# Altium schematic sheet Temp.SchDoc
size A4
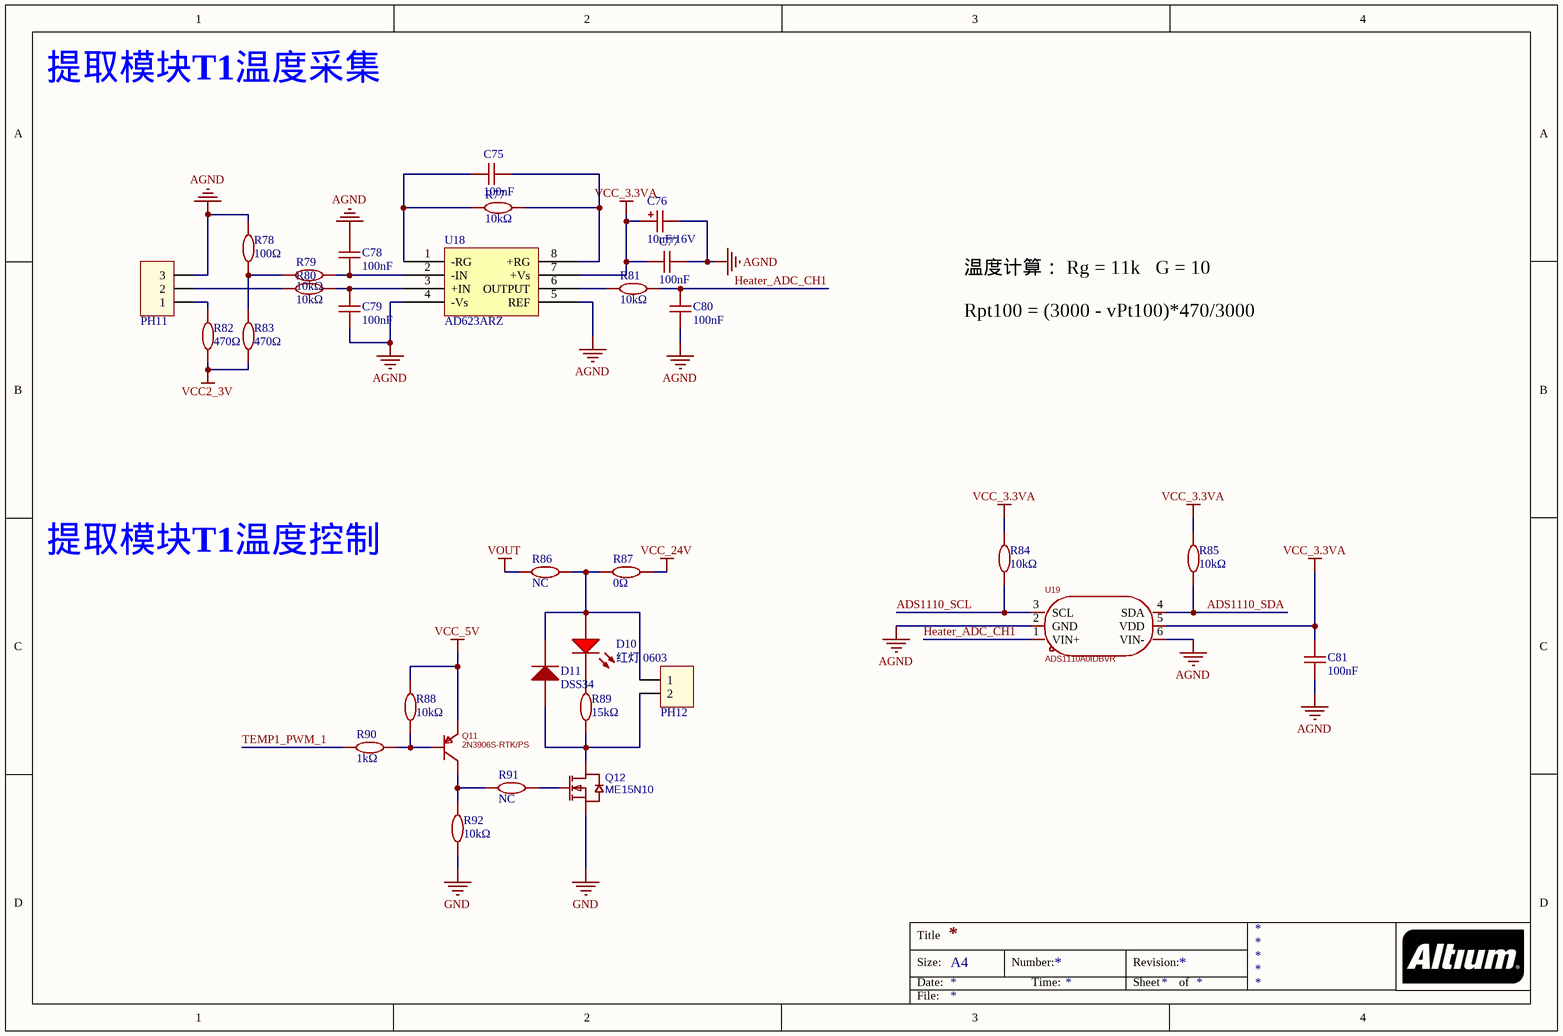
[diagram p0: Temp.SchDoc]

## Parts
C75  100nF  [C0603]
C76  10uF/16V  [CASE-A_3216]
C77  100nF  [C0603]
C78  100nF  [C0603]
C79  100nF  [C0603]
C80  100nF  [C0603]
C81  100nF  [C0603]
D10  红灯 0603  [LED_0603]
D11  DSS34  [SOD-123]
PH11  PH2.0-3P  [PH2.0-3P 弯针]  (value not drawn)
PH12  PH2.0-2P  [PH2.0-2P 弯针]  (value not drawn)
Q11  2N3906S-RTK/PS  [SOT-23-3_L2.9-W1.3-P1.90-LS2.4-TR]
Q12  ME15N10  [TO-252-2_L6.6-W6.1-P4.57-LS9.9-TL-CW]
R77  10kΩ  [R0603]
R78  100Ω  [R0603]
R79  10kΩ  [R0603]
R80  10kΩ  [R0603]
R81  10kΩ  [R0603]
R82  470Ω  [R0603]
R83  470Ω  [R0603]
R84  10kΩ  [R0603]
R85  10kΩ  [R0603]
R86  NC  [R1206]
R87  0Ω  [R1206]
R88  10kΩ  [R0603]
R89  15kΩ  [R0603]
R90  1kΩ  [R0603]
R91  NC  [R0603]
R92  10kΩ  [R0603]
U18  AD623ARZ  [SOP-8_150mil]
U19  ADS1110A0IDBVR  [SOT-23-6_L2.9-W1.6-P0.95-LS2.8-BR]

## Nets
AGND: C76.2 C77.2 C78.2 C79.1 C80.1 C81.1 PH11.3 R78.2 U18.4(-Vs) U18.5(REF) U19.2(GND) U19.6(VIN-)
GND: Q12.3(S) R92.2
VCC2_3V: R82.1 R83.1
VCC_3.3VA: C76.1 C77.1 C81.2 R84.1 R85.1 U18.7(+Vs) U19.5(VDD)
VCC_5V: Q11.1(E) R88.1
VCC_24V: R87.2
VOUT: R86.1
ADS1110_SCL: R84.2 U19.3(SCL)
ADS1110_SDA: R85.2 U19.4(SDA)
Heater_ADC_CH1: C80.2 R81.2 U19.1(VIN+)
TEMP1_PWM_1: R90.1
NetC75_1: C75.1 R77.1 U18.1(-RG)
NetC75_2: C75.2 R77.2 U18.8(+RG)
NetC78_1: C78.1 R79.1 U18.2(-IN)
NetC79_2: C79.2 R80.1 U18.3(+IN)
NetD10_A: D10.A D11.2(K) PH12.1 R86.2 R87.1
NetD10_K: D10.K R89.2
NetD11_1: D11.1(A) PH12.2 Q12.2(D) R89.1
NetPH11_1: PH11.1 R82.2
NetPH11_2: PH11.2 R80.2
NetQ11_2: Q11.2(B) R88.2 R90.2
NetQ11_3: Q11.3(C) R91.1 R92.1
NetQ12_1: Q12.1(G) R91.2
NetR78_1: R78.1 R79.2 R83.2
NetR81_1: R81.1 U18.6(OUTPUT)

## Notes on the sheet
- 提取模块T1温度采集
- 温度计算： Rg = 11k   G = 10
  Rpt100 = (3000 - vPt100)*470/3000
- 提取模块T1温度控制
- Title
- Size:
- Date:
- A4
- Number:
- Time:
- Revision:
- Sheet
- of
- File:

## Library data of the parts
C75 C77-C81 = 100nF/50V,C0603: 贴片电容,X7R; ComponentLink1Description: 供应商链接; ComponentLink1URL: http://www.szlcsc.com/product/details_16531.html
C76 = 10uF/16V,CASE-A_3216 : 钽电容;±10%;16V; ComponentLink1Description: 供应商链接; ComponentLink1URL: http://www.szlcsc.com/product/details_7643.html
D10 = 红灯 0603: 发光二极管; ComponentLink1Description: 供应商链接; ComponentLink1URL: http://www.szlcsc.com/product/details_2659.html
D11 = DSS34,SOD-123: 肖特基二极管; ComponentLink1Description: 供应商链接; ComponentLink1URL: http://www.szlcsc.com/product/details_9093.html
Q11 = 2N3906S-RTK/PS: Manufacturer: KEC; Symbol: 2N3906S-RTK/PS_C5300004; Add into BOM: yes; Current - Collector(Ic): 200mA; Collector - Emitter Voltage VCEO: 40V; Pd - Power Dissipation: 350mW; DC Current Gain: 300@10mA,1V; Transition frequency(fT): 250MHz; Current - Collector Cutoff: 50nA; Vce Saturation(VCE(sat)): 400mV@50mA,5mA; Emitter-Base Voltage(Vebo): 5V; Device: 2N3906S-RTK/PS; LCSC Part Name: 2N3906S-RTK/PS; Supplier Part: C5300004; Manufacturer Part: 2N3906S-RTK/PS; Supplier Footprint: SOT-23; JLCPCB Part Class: Extended Part; Datasheet: https://item.szlcsc.com/datasheet/2N3906S-RTK%252FPS/6051230.html; Supplier: LCSC; Convert to PCB: yes
Q12 = ME15N10: 场效应管(MOSFET);N沟道
R77 R79-R81 R84 R85 R88 R92 = 10kΩ,R0603: 电阻类型:厚膜电阻;阻值:10kΩ;精度:±1%;功率:100mW;最大工作电压:75V;温度系数:±100ppm/℃;
R78 = 100Ω,R0603: 贴片电阻
R82 R83 = 470Ω,R0603: 贴片电阻
R86 = NC,R1206: 贴片电阻
R87 = 0Ω,R1206: 贴片电阻
R89 = 15kΩ,R0603: 贴片电阻
R90 = 1kΩ,R0603: 电阻类型:厚膜电阻;阻值:1kΩ;精度:±1%;功率:125mW;最大工作电压:150V;温度系数:±100ppm/℃;
R91 = NC,R0603
U18 = AD623ARZ: 仪表放大器；（可替代芯片AD623ARZ-R7）单路；共模抑制比(CMRR) 80dB；输入偏置电流(Ib) 25nA；输入失调电压(Vos) 25uV；压摆率(SR) 0.3V/us；带宽(-3db) 800kHz；轨到轨 轨到轨输出；每个通道工作电流 305uA、375uA；输入失调电压温漂(Vos TC) 0.1uV/℃；工作电压 2.5V~6V；2.7V~12V
U19 = ADS1110A0IDBVR: Manufacturer: TI(德州仪器); Add into BOM: yes; Resolution(Bits): 16位; Sampling Rate: 15Hz; number of channels: 1; Voltage - Supply: 2.7V~5.5V; Interface: I2C; Symbol: ADS1110A0IDBVR; Device: ADS1110A0IDBVR; LCSC Part Name: 16位模拟到数字转换器 带板载参考源; Supplier Part: C16598; Manufacturer Part: ADS1110A0IDBVR; Supplier Footprint: SOT-23-6; JLCPCB Part Class: Extended Part; Datasheet: http://www.ti.com/cn/lit/gpn/ads1110; Supplier: LCSC; Convert to PCB: yes; differential input: -; Integral non - linearity: -; Operating Temperature: -